# EAGLE design RB3202S_V0.2 (EAGLE 9.4.2)

## Sheet 1 of 4
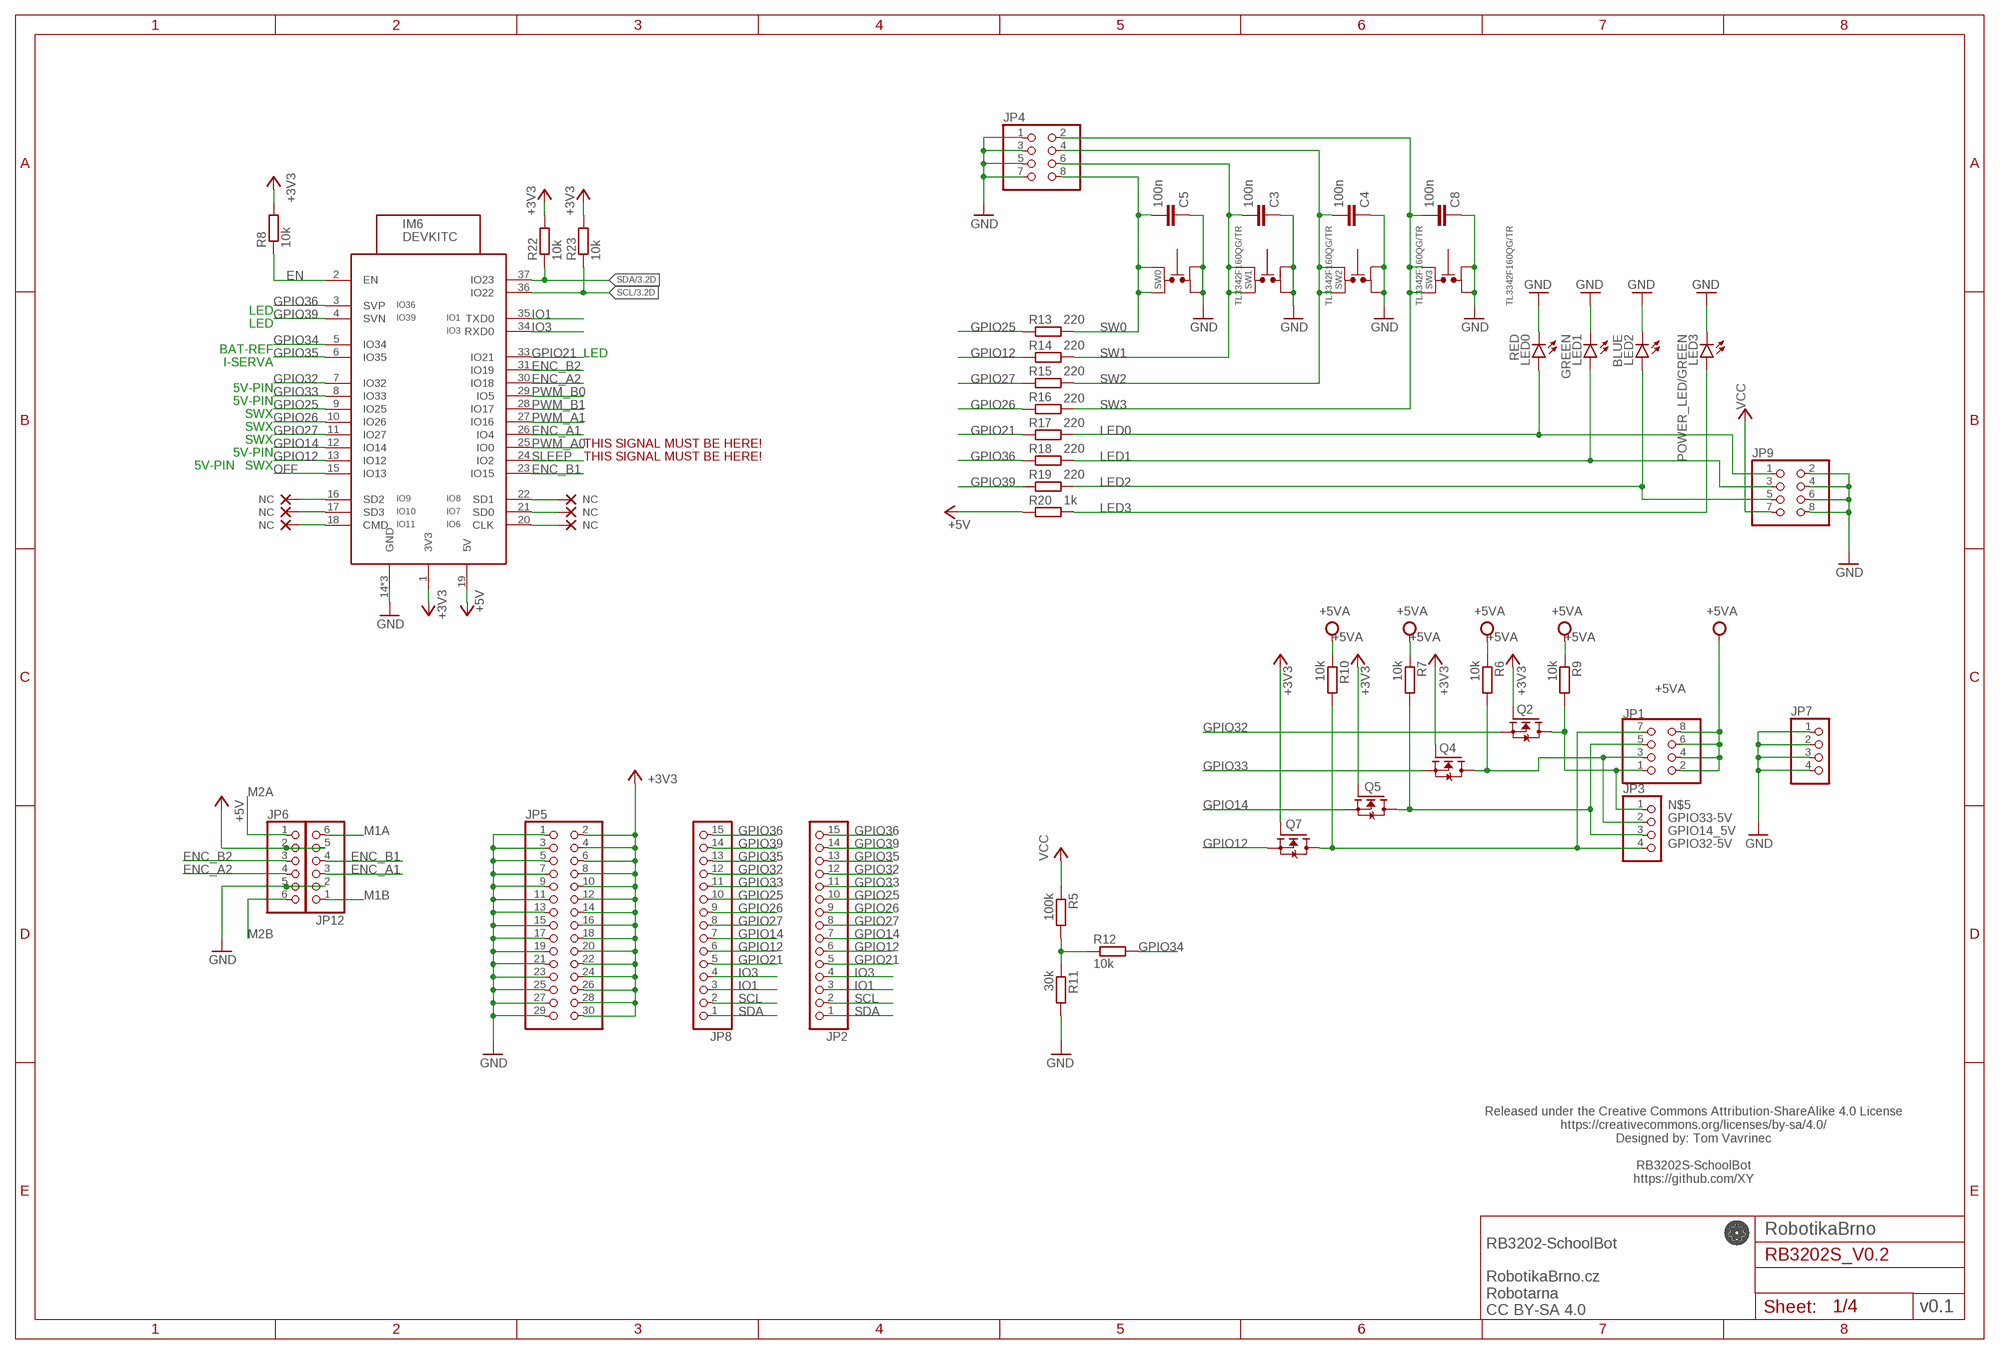
[diagram p0: schematic, sheet 1]

### Parts
C3  100n  C-EUC0402  [C0402]
C4  100n  C-EUC0402  [C0402]
C5  100n  C-EUC0402  [C0402]
C8  100n  C-EUC0402  [C0402]
IM6  DEVKITC  [DEVKITC]
JP1  PINHD-2X4  [2X04]
JP2  PINHD-1X15  [1X15]
JP3  PINHD-1X4  [1X04]
JP4  PINHD-2X4  [2X04]
JP5  PINHD-2X15  [2X15]
JP6  PINHD-1X6  [1X06]
JP7  PINHD-1X4  [1X04]
JP8  PINHD-1X15  [1X15]
JP9  PINHD-2X4  [2X04]
JP12  PINHD-1X6  [1X06]
LED0  RED  LEDSML0603  [SML0603]
LED1  GREEN  LEDSML0603  [SML0603]
LED2  BLUE  LEDSML0603  [SML0603]
LED3  POWER_LED/GREEN  LEDSML0603  [SML0603]
NC1  NC  (no package)
NC2  NC  (no package)
NC3  NC  (no package)
NC4  NC  (no package)
NC5  NC  (no package)
NC6  NC  (no package)
Q2  N-MOSFET-SOT23-GSD  [SOT23]
Q4  N-MOSFET-SOT23-GSD  [SOT23]
Q5  N-MOSFET-SOT23-GSD  [SOT23]
Q7  N-MOSFET-SOT23-GSD  [SOT23]
R5  100k  R-EU_R0402  [R0402]
R6  10k  R-EU_R0402  [R0402]
R7  10k  R-EU_R0402  [R0402]
R8  10k  R-EU_R0402  [R0402]
R9  10k  R-EU_R0402  [R0402]
R10  10k  R-EU_R0402  [R0402]
R11  30k  R-EU_R0402  [R0402]
R12  10k  R-EU_R0402  [R0402]
R13  220  R-EU_R0402  [R0402]
R14  220  R-EU_R0402  [R0402]
R15  220  R-EU_R0402  [R0402]
R16  220  R-EU_R0402  [R0402]
R17  220  R-EU_R0402  [R0402]
R18  220  R-EU_R0402  [R0402]
R19  220  R-EU_R0402  [R0402]
R20  1k  R-EU_R0402  [R0402]
R22  10k  R-EU_R0402  [R0402]
R23  10k  R-EU_R0402  [R0402]
SW0  TL3342F160QG/TR  [TL3342F160QG/TR]
SW1  TL3342F160QG/TR  [TL3342F160QG/TR]
SW2  TL3342F160QG/TR  [TL3342F160QG/TR]
SW3  TL3342F160QG/TR  [TL3342F160QG/TR]

### Nets
+3V3: IM6.1(3V3) JP5.2 JP5.4 JP5.6 JP5.8 JP5.10 JP5.12 JP5.14 JP5.16 JP5.18 JP5.20 JP5.22 JP5.24 JP5.26 JP5.28 JP5.30 Q2.1(G) Q4.1(G) Q5.1(G) Q7.1(G) R8.2 R22.2 R23.2 ; also sheet 2,3,4
+5V: IM6.19(5V) JP6.2 JP12.5 R20.1 ; also sheet 2,4
+5VA: JP1.2 JP1.4 JP1.6 JP1.8 R6.1 R7.1 R9.1 R10.1 ; also sheet 2
EN: IM6.2(EN) R8.1 ; also sheet 2
ENC_A1: IM6.26(IO4) JP12.3
ENC_A2: IM6.30(IO18) JP6.4
ENC_B1: IM6.23(IO15) JP12.4
ENC_B2: IM6.31(IO19) JP6.3
GND: C3.1 C4.1 C5.1 C8.1 IM6.14(GND) IM6.32(GND) IM6.38(GND) JP4.1 JP4.3 JP4.5 JP4.7 JP5.1 JP5.3 JP5.5 JP5.7 JP5.9 JP5.11 JP5.13 JP5.15 JP5.17 JP5.19 JP5.21 JP5.23 JP5.25 JP5.27 JP5.29 JP6.5 JP7.1 JP7.2 JP7.3 JP7.4 JP9.2 JP9.4 JP9.6 JP9.8 JP12.2 LED0.C LED1.C LED2.C LED3.C R11.2 SW0.1 SW0.2 SW1.1 SW1.2 SW2.1 SW2.2 SW3.1 SW3.2 ; also sheet 2,3,4
GPIO12: IM6.13(IO12) JP2.6 JP8.6 Q7.2(S) R14.1
GPIO14: IM6.12(IO14) JP2.7 JP8.7 Q5.2(S)
GPIO14_5V: JP1.5 JP3.3 Q5.3(D) R7.2
GPIO21: IM6.33(IO21) JP2.5 JP8.5 R17.1 ; also sheet 4
GPIO25: IM6.9(IO25) JP2.10 JP8.10 R13.1
GPIO26: IM6.10(IO26) JP2.9 JP8.9 R16.1
GPIO27: IM6.11(IO27) JP2.8 JP8.8 R15.1
GPIO32: IM6.7(IO32) JP2.12 JP8.12 Q2.2(S)
GPIO32-5V: JP1.7 JP3.4 Q7.3(D) R10.2
GPIO33: IM6.8(IO33) JP2.11 JP8.11 Q4.2(S)
GPIO33-5V: JP1.3 JP3.2 Q4.3(D) R6.2
GPIO34: IM6.5(IO34) R12.2
GPIO35: IM6.6(IO35) JP2.13 JP8.13 ; also sheet 2
GPIO36: IM6.3(SVP) JP2.15 JP8.15 R18.1 ; also sheet 4
GPIO39: IM6.4(SVN) JP2.14 JP8.14 R19.1 ; also sheet 4
IO1: IM6.35(TXD0) JP2.3 JP8.3
IO3: IM6.34(RXD0) JP2.4 JP8.4
IO9_NC: IM6.16(SD2) NC1.NC
IO9_NC1: IM6.20(CLK) NC4.NC
IO10_NC: IM6.17(SD3) NC2.NC
IO10_NC1: IM6.21(SD0) NC5.NC
IO11_NC: IM6.18(CMD) NC3.NC
IO11_NC1: IM6.22(SD1) NC6.NC
LED0: JP9.1 LED0.A R17.2
LED1: JP9.3 LED1.A R18.2
LED2: JP9.5 LED2.A R19.2
LED3: LED3.A R20.2
M1A: JP12.6 ; also sheet 2
M1B: JP12.1 ; also sheet 2
M2A: JP6.1 ; also sheet 2
M2B: JP6.6 ; also sheet 2
N$1: R5.2 R11.1 R12.1
N$5: JP1.1 JP3.1 Q2.3(D) R9.2
OFF: IM6.15(IO13) ; also sheet 2
PWM_A0: IM6.25(IO0) ; also sheet 2
PWM_A1: IM6.27(IO16) ; also sheet 2
PWM_B0: IM6.29(IO5) ; also sheet 2
PWM_B1: IM6.28(IO17) ; also sheet 2
SCL: IM6.36(IO22) JP2.2 JP8.2 R23.1 ; also sheet 3
SDA: IM6.37(IO23) JP2.1 JP8.1 R22.1 ; also sheet 3
SLEEP: IM6.24(IO2) ; also sheet 2
SW0: C5.2 JP4.8 R13.2 SW0.3 SW0.4
SW1: C3.2 JP4.6 R14.2 SW1.3 SW1.4
SW2: C4.2 JP4.4 R15.2 SW2.3 SW2.4
SW3: C8.2 JP4.2 R16.2 SW3.3 SW3.4
VCC: JP9.7 R5.1 ; also sheet 2

### Notes on the sheet
- LED
- LED
- BAT-REF
- I-SERVA | LED
- 5V-PIN
- 5V-PIN
- SWX
- SWX
- SWX
- 5V-PIN | THIS SIGNAL MUST BE HERE!
- 5V-PIN | SWX | THIS SIGNAL MUST BE HERE!
- Released under the Creative Commons Attribution-ShareAlike 4.0 License
  https://creativecommons.org/licenses/by-sa/4.0/
  Designed by: Tom Vavrinec
  
  RB3202S-SchoolBot
  https://github.com/XY
- RobotikaBrno
- v0.1
- RB3202-SchoolBot
  
  RobotikaBrno.cz
  Robotarna
  CC BY-SA 4.0

## Sheet 2 of 4
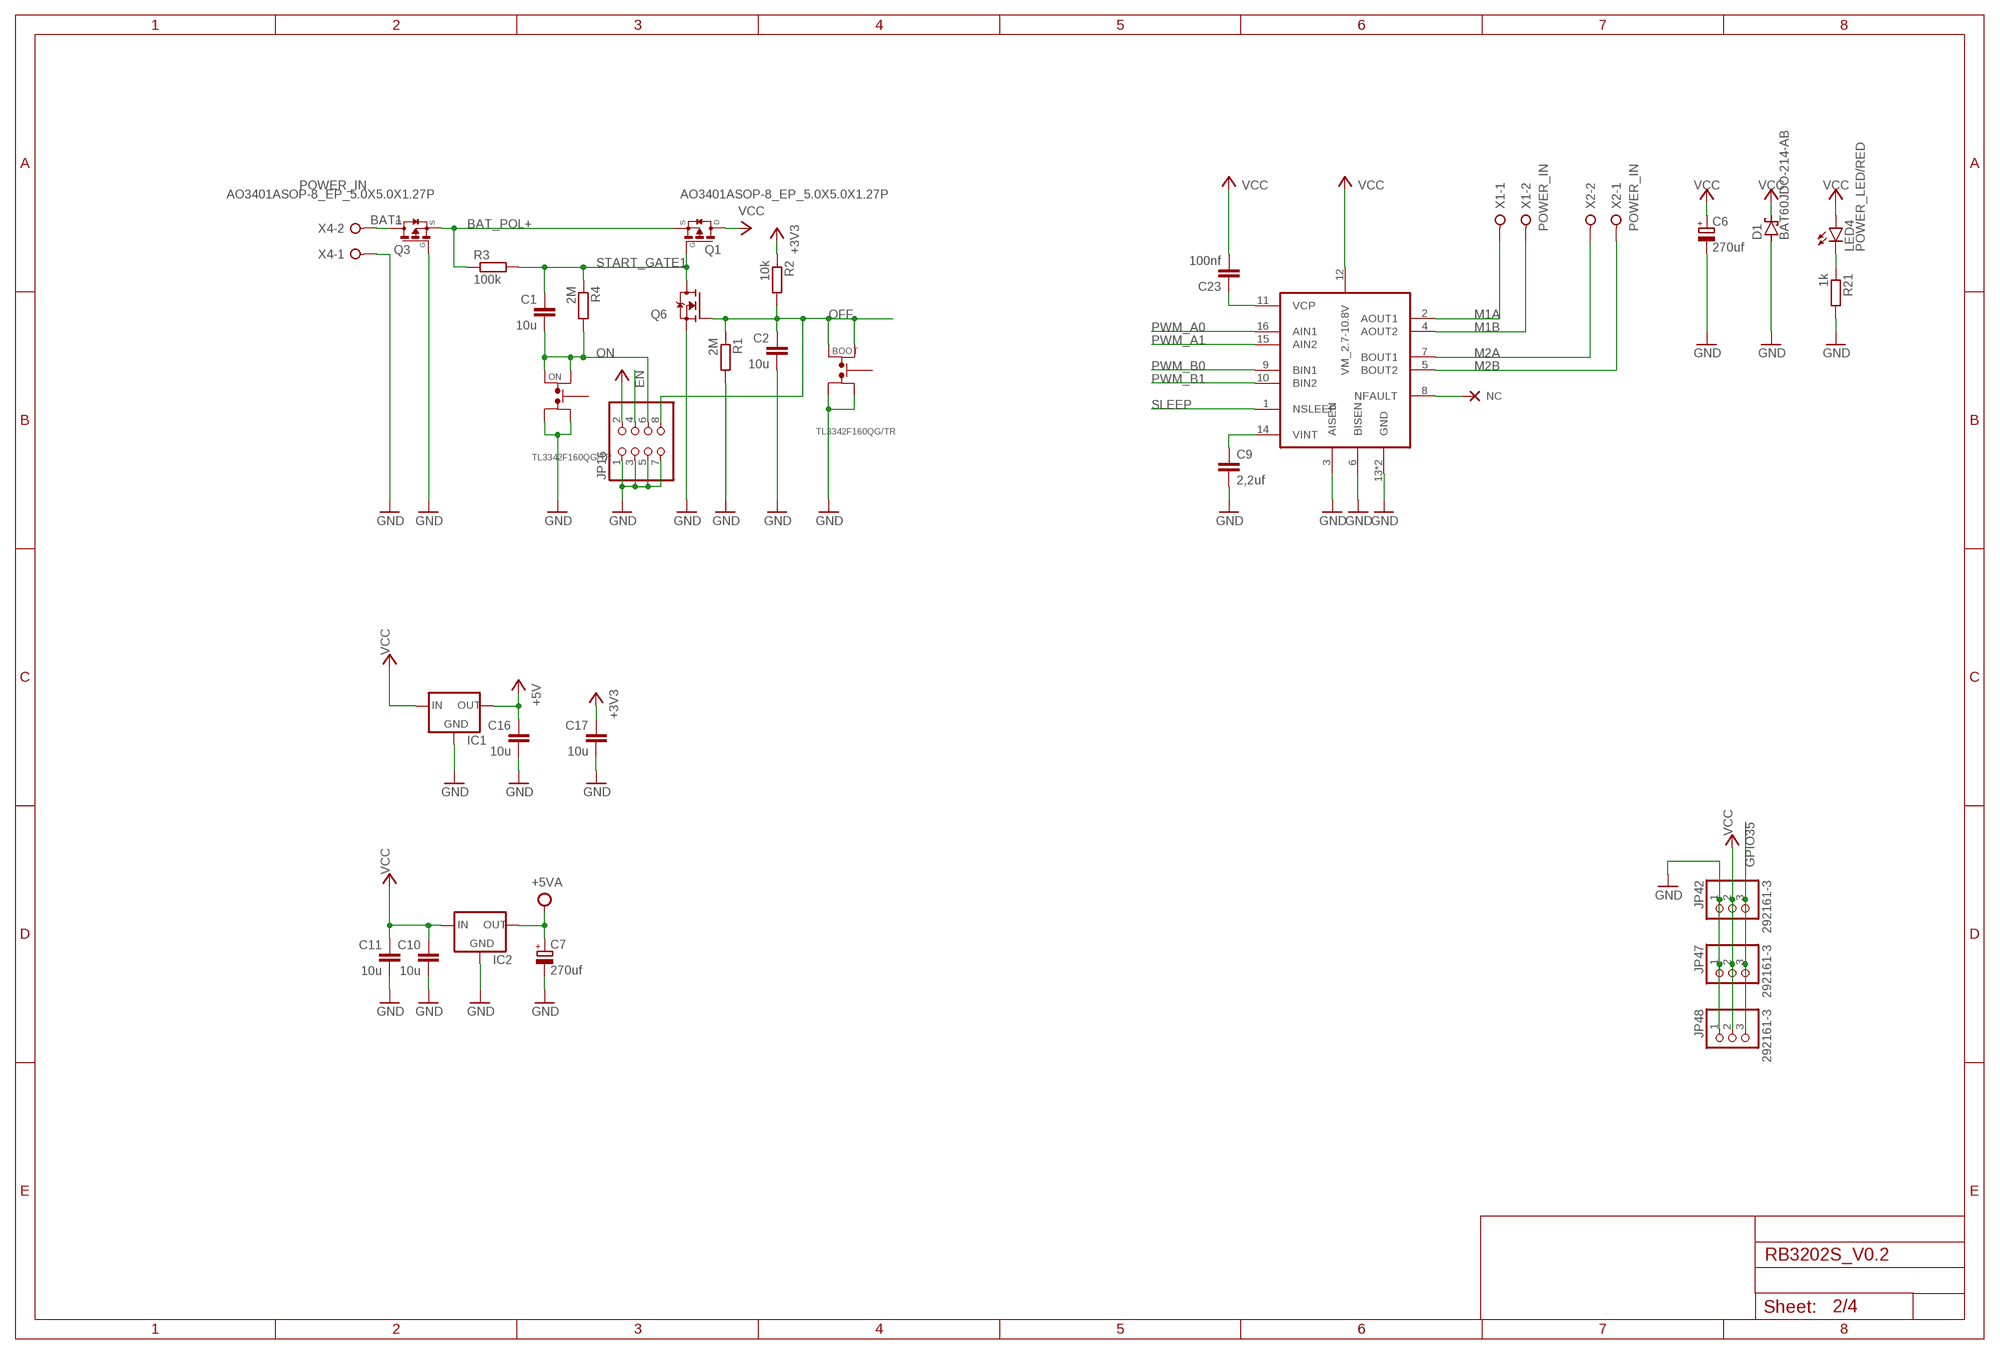
[diagram p1: schematic, sheet 2]

### Parts
BOOT  TL3342F160QG/TR  [TL3342F160QG/TR]
C1  10u  C-EUC1206  [C1206]
C2  10u  C-EUC1206  [C1206]
C6  270uf  CPOL-EU140CLH-1010  [140CLH-1010]
C7  270uf  CPOL-EU140CLH-1010  [140CLH-1010]
C9  2,2uf  C-EUC0805  [C0805]
C10  10u  C-EUC1206  [C1206]
C11  10u  C-EUC1206  [C1206]
C16  10u  C-EUC1206  [C1206]
C17  10u  C-EUC1206  [C1206]
C23  100nf  C-EUC0402  [C0402]
D1  BAT60JDO-214-AB  [DO214BA]
IC1  LM1117  [SOT223]
IC2  LM1117  [SOT223]
JP16  PINHD-2X4  [2X04]
JP42  292161-3  [292161-3]
JP47  292161-3  [292161-3]
JP48  292161-3  [292161-3]
LED4  POWER_LED/RED  LEDSML0603  [SML0603]
NC7  NC  (no package)
ON  TL3342F160QG/TR  [TL3342F160QG/TR]
Q1  AO3401ASOP-8_EP_5.0X5.0X1.27P  [SOP-8_EP_5.0X5.0X1.27P]
Q3  AO3401ASOP-8_EP_5.0X5.0X1.27P  [SOP-8_EP_5.0X5.0X1.27P]
Q6  N-MOSFET-SOT23-GSD  [SOT23]
R1  2M  R-EU_R0402  [R0402]
R2  10k  R-EU_R0402  [R0402]
R3  100k  R-EU_R0402  [R0402]
R4  2M  R-EU_R0402  [R0402]
R21  1k  R-EU_R0402  [R0402]
U$9  DRV8833CPWPR  [SOP65P640X120-17N]
X1  POWER_IN  W237-02P  [W237-132]
X2  POWER_IN  W237-02P  [W237-132]
X4  POWER_IN  W237-02P  [W237-132]

### Nets
+3V3: C17.1 R2.1 ; also sheet 1,3,4
+5V: C16.1 IC1.2(OUT) IC1.4(OUT) JP16.2 ; also sheet 1,4
+5VA: C7.+ IC2.2(OUT) IC2.4(OUT) ; also sheet 1
BAT1: Q3.5(D) Q3.6(D) Q3.7(D) Q3.8(D) Q3.9(D) X4.2
BAT_POL+: Q1.1(S) Q1.2(S) Q1.3(S) Q3.1(S) Q3.2(S) Q3.3(S) R3.1
EN: JP16.4 ; also sheet 1
GND: BOOT.1 BOOT.2 C2.2 C6.- C7.- C9.2 C10.2 C11.2 C16.2 C17.2 D1.A IC1.1(GND) IC2.1(GND) JP16.1 JP16.3 JP16.5 JP16.7 JP42.1 JP47.1 JP48.1 ON.1 ON.2 Q3.4(G) Q6.2(S) R1.2 R21.2 U$9.3(AISEN) U$9.6(BISEN) U$9.13(GND) U$9.17(GND) X4.1 ; also sheet 1,3,4
GPIO35: JP42.3 JP47.3 JP48.3 ; also sheet 1
IO9_NC2: NC7.NC U$9.8(NFAULT)
M1A: U$9.2(AOUT1) X1.1 ; also sheet 1
M1B: U$9.4(AOUT2) X1.2 ; also sheet 1
M2A: U$9.7(BOUT1) X2.2 ; also sheet 1
M2B: U$9.5(BOUT2) X2.1 ; also sheet 1
N$2: LED4.C R21.1
N$23: C9.1 U$9.14(VINT)
N$25: C23.1 U$9.11(VCP)
OFF: BOOT.3 BOOT.4 C2.1 JP16.8 Q6.1(G) R1.1 R2.2 ; also sheet 1
ON: C1.2 JP16.6 ON.3 ON.4 R4.2
PWM_A0: U$9.16(AIN1) ; also sheet 1
PWM_A1: U$9.15(AIN2) ; also sheet 1
PWM_B0: U$9.9(BIN1) ; also sheet 1
PWM_B1: U$9.10(BIN2) ; also sheet 1
SLEEP: U$9.1(NSLEEP) ; also sheet 1
START_GATE1: C1.1 Q1.4(G) Q6.3(D) R3.2 R4.1
VCC: C6.+ C10.1 C11.1 C23.2 D1.C IC1.3(IN) IC2.3(IN) JP42.2 JP47.2 JP48.2 LED4.A Q1.5(D) Q1.6(D) Q1.7(D) Q1.8(D) Q1.9(D) U$9.12(VM_2.7-10.8V) ; also sheet 1

## Sheet 3 of 4
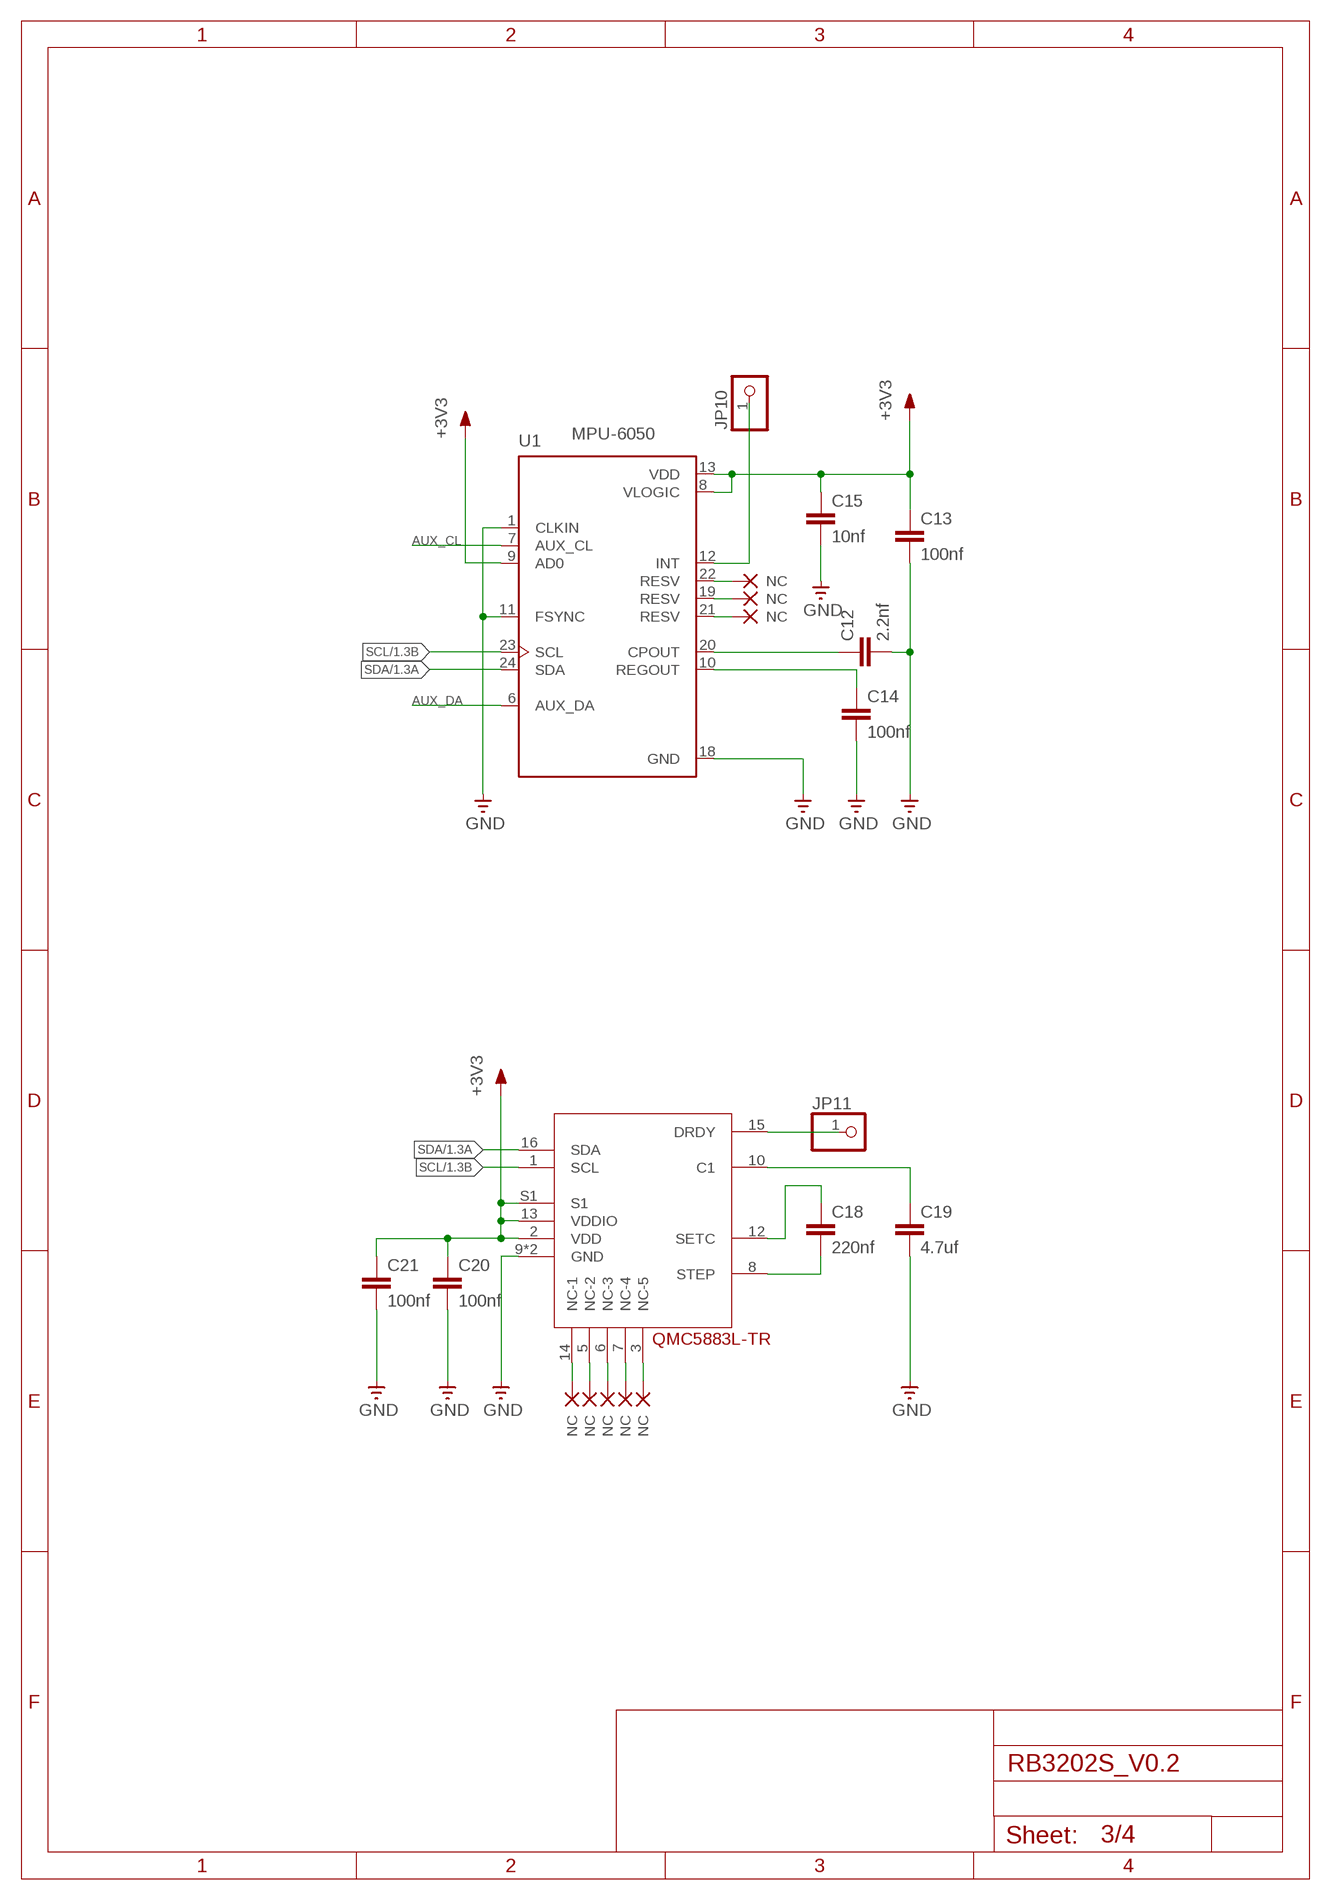
[diagram p2: schematic, sheet 3]

### Parts
C12  2.2nf  C-EUC0402  [C0402]
C13  100nf  C-EUC0402  [C0402]
C14  100nf  C-EU  [C0402P]
C15  10nf  C-EUC0402  [C0402]
C18  220nf  C-EUC0402  [C0402]
C19  4.7uf  C-EUC0805  [C0805]
C20  100nf  C-EU  [C0402P]
C21  100nf  C-EU  [C0402P]
IC3  QMC5883L-TR  [QMC5882L-TR]
JP10  PINHD-1X1  [1X01]
JP11  PINHD-1X1  [1X01]
NC8  NC  (no package)
NC9  NC  (no package)
NC10  NC  (no package)
NC11  NC  (no package)
NC12  NC  (no package)
NC13  NC  (no package)
NC14  NC  (no package)
NC15  NC  (no package)
U1  MPU-6050  [QFN50P400X400X95-24N]

### Nets
+3V3: C13.1 C15.1 C20.1 C21.1 IC3.2(VDD) IC3.13(VDDIO) IC3.S1 U1.8(VLOGIC) U1.9(AD0) U1.13(VDD) ; also sheet 1,2,4
AUX_CL: U1.7(AUX_CL)
AUX_DA: U1.6(AUX_DA)
GND: C12.2 C13.2 C14.2 C15.2 C19.2 C20.2 C21.2 IC3.9(GND) IC3.11(GND) U1.1(CLKIN) U1.11(FSYNC) U1.18(GND) ; also sheet 1,2,4
INT_MPU5060: JP10.1 U1.12(INT)
IO9_NC3: IC3.5(NC-2) NC9.NC
IO9_NC4: NC8.NC U1.19(RESV)
IO9_NC5: NC14.NC U1.21(RESV)
IO9_NC6: IC3.14(NC-1) NC11.NC
IO9_NC7: IC3.3(NC-5) NC12.NC
IO9_NC8: IC3.7(NC-4) NC15.NC
IO10_NC2: IC3.6(NC-3) NC10.NC
IO10_NC4: NC13.NC U1.22(RESV)
N$3: C12.1 U1.20(CPOUT)
N$4: C14.1 U1.10(REGOUT)
N$60: C18.1 IC3.12(SETC)
N$62: C18.2 IC3.8(STEP)
N$66: C19.1 IC3.10(C1)
QMC5883-INTERRUPT: IC3.15(DRDY) JP11.1
SCL: IC3.1(SCL) U1.23(SCL) ; also sheet 1
SDA: IC3.16(SDA) U1.24(SDA) ; also sheet 1

## Sheet 4 of 4
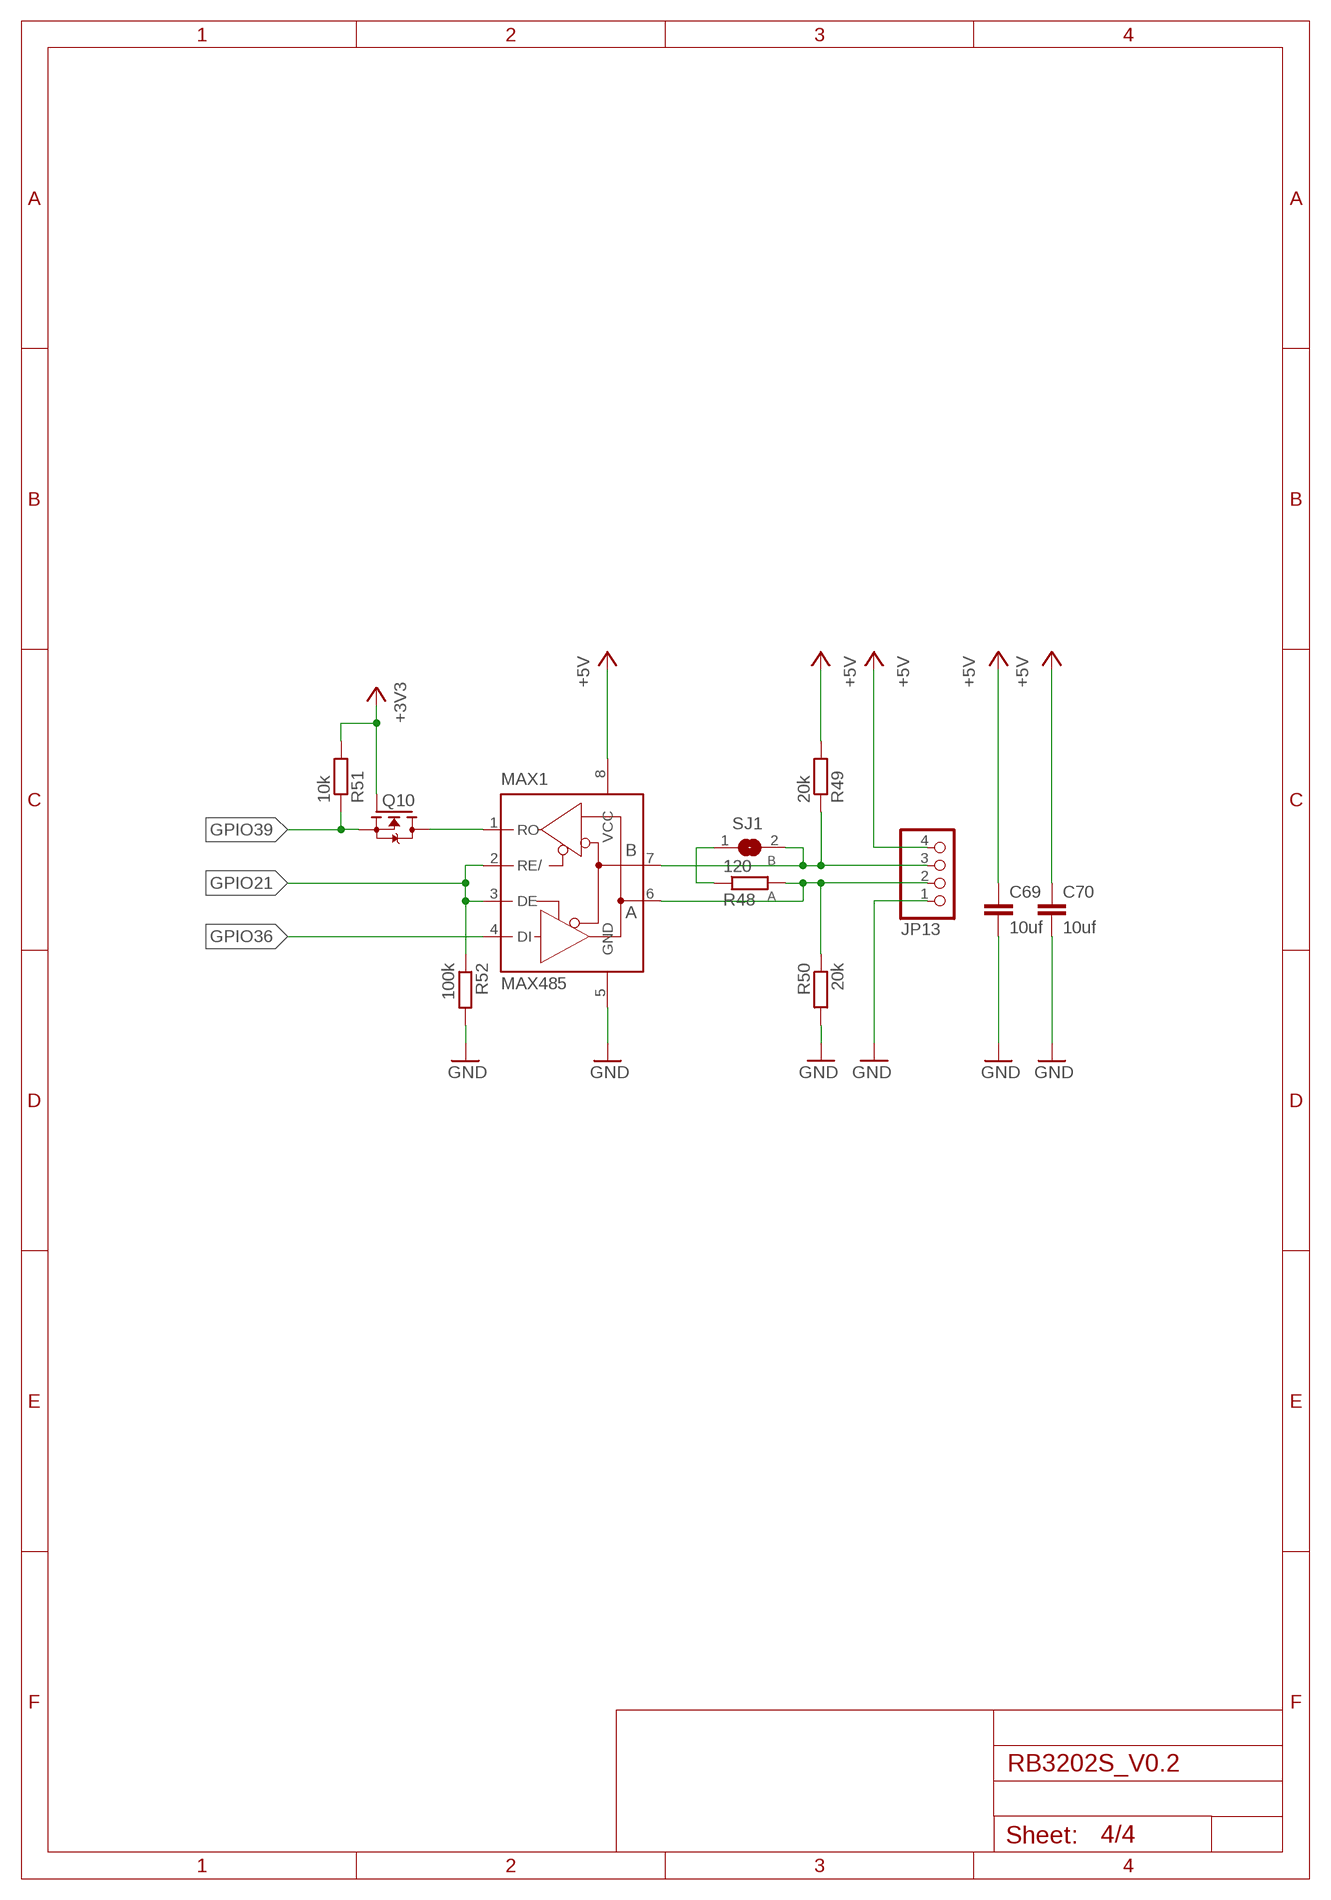
[diagram p3: schematic, sheet 4]

### Parts
C69  10uf  C-EUC0805  [C0805]
C70  10uf  C-EUC0805  [C0805]
JP13  PINHD-1X4  [1X04]
MAX1  MAX485  [SO08]
Q10  N-MOSFET-SOT23-GSD  [SOT23]
R48  120  R-EU_R0402  [R0402]
R49  20k  R-EU_R0402  [R0402]
R50  20k  R-EU_R0402  [R0402]
R51  10k  R-EU_R0402  [R0402]
R52  100k  R-EU_R0402  [R0402]
SJ1  SJ  [SJ]

### Nets
+3V3: Q10.1(G) R51.2 ; also sheet 1,2,3
+5V: C69.1 C70.1 JP13.4 MAX1.8(VCC) R49.2 ; also sheet 1,2
A: JP13.2 MAX1.6(A) R48.2 R50.1
B: JP13.3 MAX1.7(B) R49.1 SJ1.2
GND: C69.2 C70.2 JP13.1 MAX1.5(GND) R50.2 R52.2 ; also sheet 1,2,3
GPIO21: MAX1.2(RE/) MAX1.3(DE) R52.1 ; also sheet 1
GPIO36: MAX1.4(DI) ; also sheet 1
GPIO39: Q10.2(S) R51.1 ; also sheet 1
N$6: R48.1 SJ1.1
RX-485-5V: MAX1.1(RO) Q10.3(D)

## Library data of the parts
BOOT ON SW0 SW1-SW3 = Switch:TL3342F160QG/TR: SWITCH TACTILE SPST-NO 0.05A 12V Manufacturer's datasheet <http://spec_sheets.e-switch.com/specs/P010632.pdf>; CREATED_BY: PCBLayout.com; DIGI_KEY_PART_NUMBER: EG2531CT-ND; MANUFACTURER: E-Switch; MPN: TL3342F160QG/TR; PACKAGE: SPST_NO
C1-C5 C8 C10-C21 = rcl_upravena:C-EU: CAPACITOR, European symbol
C6 C7 = rcl:CPOL-EU: POLARIZED CAPACITOR, European symbol; SPICEPREFIX: C
C9 C23 = resistor:C-EU: CAPACITOR, European symbol
C69 C70 = rcl:C-EU: CAPACITOR, European symbol; SPICEPREFIX: C
D1 = diode:BAT60J: Schottky barrier diode Source: www.st.com, BAT60J.pdf
IC1 IC2 = v-reg-2:LM1117
IC3 = QMC5883L-TR:QMC5883L-TR
IM6 = esp32:DEVKITC
JP1 JP4 JP9 JP16 = pinhead:PINHD-2X4: PIN HEADER
JP2 JP8 = pinhead:PINHD-1X15: PIN HEADER
JP3 JP7 JP13 = pinhead:PINHD-1X4: PIN HEADER
JP5 = pinhead:PINHD-2X15: PIN HEADER
JP6 JP12 = pinhead:PINHD-1X6: PIN HEADER
JP10 JP11 = pinhead:PINHD-1X1: PIN HEADER
JP42 JP47 JP48 = iServo_connector:292161-3
LED0 LED1-LED4 = led:LED: LED OSRAM: - CHIPLED LG R971, LG N971, LY N971, LG Q971, LY Q971, LO R971, LY R971 LH N974, LH R974 LS Q976, LO Q976, LY Q976 LO Q996 - Hyper CHIPLED LW Q18S LB Q993, LB Q99A, LB R99A - SideLED LS A670, LO A670, LY A670, LG A670, LP A670 LB A673, LV A673, LT A673, LW A673 LH A674 LY A675 LS A676, LA A676, LO A676, LY A676, LW A676 LS A679, LY A679, LG A679 - Hyper Micro SIDELED® LS Y876, LA Y876, LO Y876, LY Y876 LT Y87S - SmartLED LW L88C, LW L88S LB L89C, LB L89S, LG L890 LS L89K, LO L89K, LY L89K LS L896, LA L896, LO L896, LY L896 - TOPLED LS T670, LO T670, LY T670, LG T670, LP T670 LSG T670, LSP T670, LSY T670, LOP T670, LYG T670 LG T671, LOG T671, LSG T671 LB T673, LV T673, LT T673, LW T673 LH T674 LS T676, LA T676, LO T676, LY T676, LB T676, LH T676, LSB T676, LW T676 LB T67C, LV T67C, LT T67C, LS T67K, LO T67K, LY T67K, LW E67C LS E67B, LA E67B, LO E67B, LY E67B, LB E67C, LV E67C, LT E67C LW T67C LS T679, LY T679, LG T679 LS T770, LO T770, LY T770, LG T770, LP T770 LB T773, LV T773, LT T773, LW T773 LH T774 LS E675, LA E675, LY E675, LS T675 LS T776, LA T776, LO T776, LY T776, LB T776 LHGB T686 LT T68C, LB T68C - Hyper Mini TOPLED® LB M676 - Mini TOPLED Santana® LG M470 LS M47K, LO M47K, LY M47K Source: http://www.osram.convergy.de LUXEON: - LUMILED® LXK2-PW12-R00, LXK2-PW12-S00, LXK2-PW14-U00, LXK2-PW14-V00 LXK2-PM12-R00, LXK2-PM12-S00, LXK2-PM14-U00 LXK2-PE12-Q00, LXK2-PE12-R00, LXK2-PE12-S00, LXK2-PE14-T00, LXK2-PE14-U00 LXK2-PB12-K00, LXK2-PB12-L00, LXK2-PB12-M00, LXK2-PB14-N00, LXK2-PB14-P00, LXK2-PB14-Q00 LXK2-PR12-L00, LXK2-PR12-M00, LXK2-PR14-Q00, LXK2-PR14-R00 LXK2-PD12-Q00, LXK2-PD12-R00, LXK2-PD12-S00 LXK2-PH12-R00, LXK2-PH12-S00 LXK2-PL12-P00, LXK2-PL12-Q00, LXK2-PL12-R00 Source: www.luxeon.com KINGBRIGHT: KA-3528ASYC Source: www.kingbright.com
MAX1 = maxim:MAX485
NC1-NC15 = NC:NC: _EXTERNAL_
Q1 Q3 = transistor-fet:AO3401A: P-Channel Enhancement MOSFET
Q2 Q4-Q7 Q10 = transistors:N-MOSFET
R1-R4 R8 R21-R23 = rcl_upravena:R-EU_: RESISTOR, European symbol
R5-R7 R9-R20 R48-R52 = rcl:R-EU_: RESISTOR, European symbol; SPICEPREFIX: R
SJ1 = jumper:SJ: SMD solder JUMPER
U1 = MPU-6050:MPU-6050: MPU-6050 Six-Axis (Gyro + Accelerometer) MEMS MotionTracking™ Devices; AVAILABILITY: Unavailable; DESCRIPTION: 3-axis gyroscope, 3-axis accelerometer in a 4x4x0.9 housing; MF: TDK InvenSense; MP: MPU-6050; PACKAGE: QFN-24 InvenSense; PRICE: None
U$9 = DRV8833CPWPR:DRV8833CPWPR: 1A Low Voltage Stepper or Single/Dual Brushed DC Motor Driver (PWM Ctrl) 16-HTSSOP -40 to 85; AVAILABILITY: Unavailable; DESCRIPTION: Motor Driver Power MOSFET PWM 16-HTSSOP; MF: Texas Instruments; MP: DRV8833CPWPR; PACKAGE: HTSSOP-16 Texas Instruments; PRICE: None
X1 X2 X4 = con-wago-508:W237-02P: WAGO SREW CLAMP; OC_FARNELL: unknown; OC_NEWARK: unknown

## Net classes
0 default: width 0.2 mm, drill 0.35 mm, clearance 0.2 mm

## Board
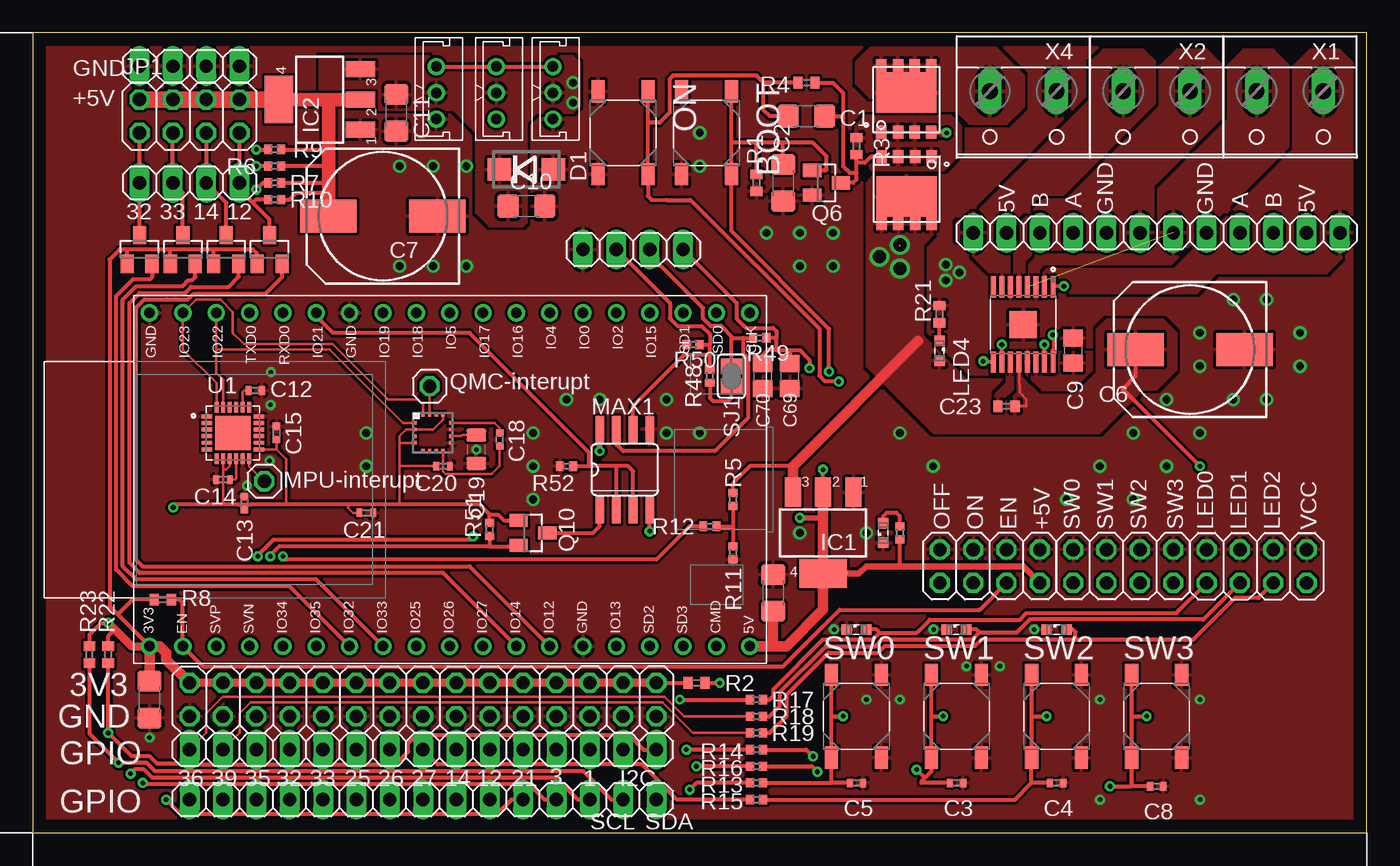
[diagram p4: board, top side]
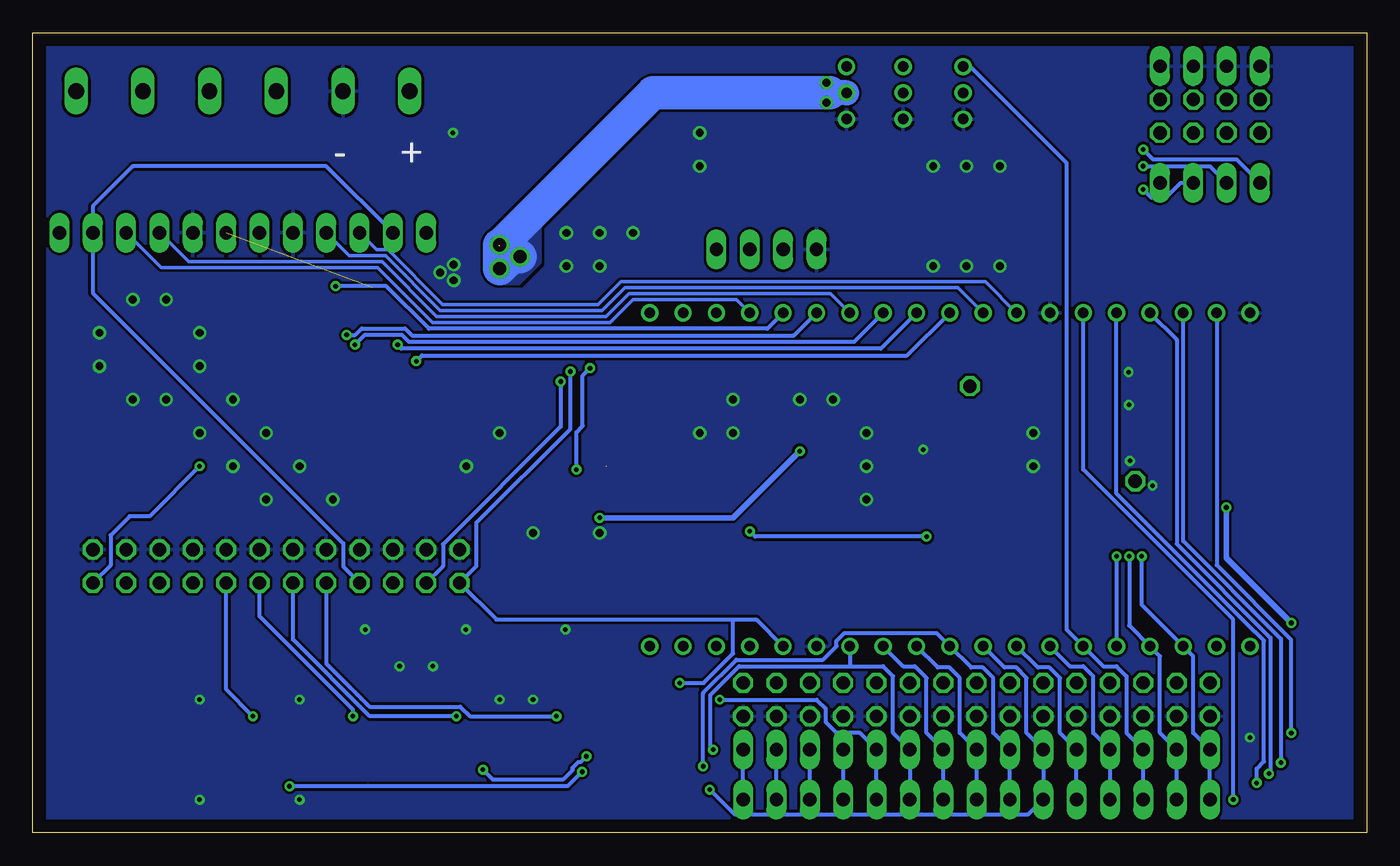
[diagram p5: board, bottom side, seen from below]

Size 101.6 x 60.96 mm. Coordinates in mm from the lower left corner, seen from the top.
Outline: 0,0 101.6,0 101.6,60.96 0,60.96 0,0
Copper layers (1*16): Top 0.035mm / dielectric 1.5mm / Bottom 0.035mm
Design rules "default *": minimum track width 6mil, minimum drill 0.35mm, track to track 6mil, track to pad 6mil, pad to pad 6mil, via to via 6mil, smd to smd 6mil, copper to edge 40mil, drill to drill 6mil, minimum pad ring 10mil, minimum via ring 8mil, stop-mask expansion 4mil, vias tented up to drill 0mil, thermal gap 10mil

### Footprints (pad centres in the part's own frame; a part is rotated, then mirrored left to right if it is on the bottom)
TL3342F160QG/TR = smd 1.7 x 1: 1 -3.15,-1.9; 2 3.15,-1.9; 3 -3.15,1.9; 4 3.15,1.9
C1206 = smd 1.6 x 1.8: 1 -1.4,0; 2 1.4,0
C0402 = smd 0.5 x 0.6: 1 -0.5,0; 2 0.5,0
140CLH-1010 = smd 4.3 x 2.5: + 4.15,0; - -4.15,0
C0805 = smd 1.3 x 1.5: 1 -0.95,0; 2 0.95,0
C0402P = smd 0.45 x 0.6: 1 -0.525,0; 2 0.525,0
C0805' = smd 1 x 1.5: 1 -1.1,0; 2 1.05,0
C0402' = smd 0.7 x 0.9: 1 -0.65,0; 2 0.65,0
DO214BA = smd 1.8 x 1.7: A 2.05,0; C -2.05,0
SOT223 = smd 1.219 x 2.235: 1 -2.311,-3.099; 2 0,-3.099; 3 2.311,-3.099 | smd 3.6 x 2.2: 4 0,3.099
QMC5882L-TR = smd 0.325 x 0.25: 1 -1.397,0.762; 2 -1.397,0.254; 3 -1.397,-0.254; 9 1.397,-0.762; 10 1.397,-0.254; 11 1.397,0.254; 12 1.397,0.762; S1 -1.397,-0.762 | smd 0.25 x 0.325: 5 -0.762,-1.397; 6 -0.254,-1.397; 7 0.254,-1.397; 8 0.762,-1.397; 13 0.762,1.397; 14 0.254,1.397; 15 -0.254,1.397; 16 -0.762,1.397
DEVKITC = drill 0.8: 1 -12.7,46.99; 2 -12.7,44.45; 3 -12.7,41.91; 4 -12.7,39.37; 5 -12.7,36.83; 6 -12.7,34.29; 7 -12.7,31.75; 8 -12.7,29.21; 9 -12.7,26.67; 10 -12.7,24.13; 11 -12.7,21.59; 12 -12.7,19.05; 13 -12.7,16.51; 14 -12.7,13.97; 15 -12.7,11.43; 16 -12.7,8.89; 17 -12.7,6.35; 18 -12.7,3.81; 19 -12.7,1.27; 20 12.7,1.27; 21 12.7,3.81; 22 12.7,6.35; 23 12.7,8.89; 24 12.7,11.43; 25 12.7,13.97; 26 12.7,16.51; 27 12.7,19.05; 28 12.7,21.59; 29 12.7,24.13; 30 12.7,26.67; 31 12.7,29.21; 32 12.7,31.75; 33 12.7,34.29; 34 12.7,36.83; 35 12.7,39.37; 36 12.7,41.91; 37 12.7,44.45; 38 12.7,46.99
2X04 = drill 1.016 octagon: 1 -3.81,-1.27; 2 -3.81,1.27; 3 -1.27,-1.27; 4 -1.27,1.27; 5 1.27,-1.27; 6 1.27,1.27; 7 3.81,-1.27; 8 3.81,1.27
1X15 = drill 1.016 long: 1 -17.78,0; 2 -15.24,0; 3 -12.7,0; 4 -10.16,0; 5 -7.62,0; 6 -5.08,0; 7 -2.54,0; 8 0,0; 9 2.54,0; 10 5.08,0; 11 7.62,0; 12 10.16,0; 13 12.7,0; 14 15.24,0; 15 17.78,0
1X04 = drill 1.016 long: 1 -3.81,0; 2 -1.27,0; 3 1.27,0; 4 3.81,0
2X15 = drill 1.016 octagon: 1 -17.78,-1.27; 2 -17.78,1.27; 3 -15.24,-1.27; 4 -15.24,1.27; 5 -12.7,-1.27; 6 -12.7,1.27; 7 -10.16,-1.27; 8 -10.16,1.27; 9 -7.62,-1.27; 10 -7.62,1.27; 11 -5.08,-1.27; 12 -5.08,1.27; 13 -2.54,-1.27; 14 -2.54,1.27; 15 0,-1.27; 16 0,1.27; 17 2.54,-1.27; 18 2.54,1.27; 19 5.08,-1.27; 20 5.08,1.27; 21 7.62,-1.27; 22 7.62,1.27; 23 10.16,-1.27; 24 10.16,1.27; 25 12.7,-1.27; 26 12.7,1.27; 27 15.24,-1.27; 28 15.24,1.27; 29 17.78,-1.27; 30 17.78,1.27
1X06 = drill 1.016 long: 1 -6.35,0; 2 -3.81,0; 3 -1.27,0; 4 1.27,0; 5 3.81,0; 6 6.35,0
1X01 = drill 1.016 octagon: 1 0,0
292161-3 = drill 0.8: 1 -2,0; 2 0,0; 3 2,0
SML0603 = smd 0.8 x 0.8: A 0.75,0; C -0.75,0
SO08 = smd 0.66 x 2.032: 1 -1.905,-3.073; 2 -0.635,-3.073; 3 0.635,-3.073; 4 1.905,-3.073; 5 1.905,3.073; 6 0.635,3.073; 7 -0.635,3.073; 8 -1.905,3.073
SOP-8_EP_5.0X5.0X1.27P = smd 0.8 x 1: 1 1.915,2.5; 2 0.645,2.5; 3 -0.625,2.5; 4 -1.895,2.5; 5 -1.895,-2.58; 6 -0.625,-2.58; 7 0.645,-2.58; 8 1.915,-2.58 | smd 4.61 x 3.1: 9 0.01,-0.53
SOT23 = smd 1 x 1.4: 1 -0.95,-1.1; 2 0.95,-1.1; 3 0,1.1
R0402 = smd 0.7 x 0.9: 1 -0.65,0; 2 0.65,0
R0402' = smd 0.6 x 0.7: 1 -0.5,0; 2 0.5,0
SJ = smd 1.168 x 1.6: 1 -0.762,0; 2 0.762,0
QFN50P400X400X95-24N = smd 0.8 x 0.3: 1 -1.97,1.25; 2 -1.97,0.75; 3 -1.97,0.25; 4 -1.97,-0.25; 5 -1.97,-0.75; 6 -1.97,-1.25; 13 1.97,-1.25; 14 1.97,-0.75; 15 1.97,-0.25; 16 1.97,0.25; 17 1.97,0.75; 18 1.97,1.25 | smd 0.3 x 0.8: 7 -1.25,-1.97; 8 -0.75,-1.97; 9 -0.25,-1.97; 10 0.25,-1.97; 11 0.75,-1.97; 12 1.25,-1.97; 19 1.25,1.97; 20 0.75,1.97; 21 0.25,1.97; 22 -0.25,1.97; 23 -0.75,1.97; 24 -1.25,1.97 | smd 2.7 x 2.6: P$1 0,0
SOP65P640X120-17N = smd 1.57 x 0.41: 1 -2.87,2.275; 2 -2.87,1.625; 3 -2.87,0.975; 4 -2.87,0.325; 5 -2.87,-0.325; 6 -2.87,-0.975; 7 -2.87,-1.625; 8 -2.87,-2.275; 9 2.87,-2.275; 10 2.87,-1.625; 11 2.87,-0.975; 12 2.87,-0.325; 13 2.87,0.325; 14 2.87,0.975; 15 2.87,1.625; 16 2.87,2.275 | smd 2.07 x 2.105: 17 0,0
W237-132 = drill 1.194 long: 1 -2.54,-0.635; 2 2.54,-0.635

### Placement (x,y rotation side)
BOOT  51.31,53.34 270 top
C1  58.93,54.61 180 top
C2  57.15,49.53 270 top
C3  70.36,3.81 180 top
C4  77.98,3.81 180 top
C5  62.74,3.81 180 top
C6  88.14,36.83 180 top
C7  26.67,46.99 180 top
C8  85.6,3.56 180 top
C9  79.25,36.75 90 top
C10  37.59,47.75 0 top
C11  27.69,54.86 270 top
C12  16.94,33.71 0 top
C13  16.13,25.12 90 top
C14  14.49,26.92 180 top
C15  18.57,30.48 90 top
C16  56.39,18.29 90 top
C17  8.89,10.16 270 top
C18  35.56,29.97 270 top
C19  4.7uf  [C0805']  33.78,29.21 270 top
C20  31.24,27.94 0 top
C21  25.4,24.38 0 top
C23  100nf  [C0402']  74.17,32.51 0 top
C69  57.66,34.8 270 top
C70  55.6,34.8 270 top
D1  37.59,50.55 0 top
IC1  60.2,22.86 180 top
IC2  21.84,55.88 90 top
IC3  30.48,30.48 0 top
IM6  55.88,26.92 90 top
JP1  11.94,54.61 0 top
JP2  29.72,6.35 180 top
JP3  11.94,49.53 0 top
JP4  83.06,20.32 180 top
JP5  29.72,10.16 0 top
JP6  77.98,45.72 0 top
JP7  11.94,58.42 0 top
JP8  29.72,2.54 180 top
JP9  93.22,20.32 0 top
JP10  17.63,26.8 0 top
JP11  30.23,34.04 0 top
JP12  93.22,45.72 0 top
JP13  45.72,44.45 0 top
JP16  72.9,20.32 180 top
JP42  30.73,56.39 90 top
JP47  39.62,56.39 90 top
JP48  35.31,56.39 90 top
LED0  62.74,15.49 0 top
LED1  70.36,15.49 0 top
LED2  77.98,15.49 0 top
LED3  64.77,22.86 90 top
LED4  69.06,36.73 270 top
MAX1  45.09,27.69 0 top
ON  44.96,53.34 270 top
Q1  66.55,49.02 0 top
Q2  8.13,44.45 0 top
Q3  66.55,55.88 180 top
Q4  11.43,44.45 0 top
Q5  14.73,44.45 0 top
Q6  60.45,49.53 270 top
Q7  18.03,44.45 0 top
Q10  38.1,22.86 270 top
R1  55.12,49.53 270 top
R2  50.55,11.43 0 top
R3  62.74,52.32 270 top
R4  58.93,57.15 180 top
R5  100k  [R0402']  53.34,25.4 270 top
R6  10k  [R0402']  18.41,50.8 180 top
R7  10k  [R0402']  18.41,49.53 180 top
R8  9.91,17.78 180 top
R9  10k  [R0402']  18.41,52.07 180 top
R10  10k  [R0402']  18.41,48.26 180 top
R11  30k  [R0402']  53.34,21.34 270 top
R12  10k  [R0402']  51.56,23.37 180 top
R13  220  [R0402']  55.12,3.81 0 top
R14  220  [R0402']  55.12,6.35 0 top
R15  220  [R0402']  55.12,2.54 0 top
R16  220  [R0402']  55.12,5.08 0 top
R17  220  [R0402']  55.12,10.16 0 top
R18  220  [R0402']  55.12,8.89 0 top
R19  220  [R0402']  55.12,7.62 0 top
R20  1k  [R0402']  66.04,22.86 90 top
R21  69.06,39.52 90 top
R22  5.74,13.59 90 top
R23  4.32,13.59 90 top
R48  120  [R0402']  51.56,34.8 90 top
R49  20k  [R0402']  55.37,37.72 0 top
R50  20k  [R0402']  50.29,37.21 180 top
R51  10k  [R0402']  34.8,23.11 90 top
R52  100k  [R0402']  40.64,27.94 180 top
SJ1  53.21,34.8 90 top
SW0  62.74,8.89 90 top
SW1  70.36,8.89 90 top
SW2  77.98,8.89 90 top
SW3  85.6,8.89 90 top
U1  15.24,30.48 0 top
U$9  75.44,38.73 270 top
X1  95.76,55.88 180 top
X2  85.6,55.88 180 top
X4  75.44,55.88 180 top

### Tracks (layer width: path | path; a pad name or v marks a point on that pad's centre or on a via)
+3V3  (via drill 0.35)
  Top 0.2: U1.13 18.57,29.23 | 19.3,25.05 19.3,28.5 18.57,29.23 | 19.3,25.05 16.13,25.05 | U1.8 14.49,27.69 | U1.9 14.99,27.94 14.73,27.69 14.49,27.69 | C15.1 18.57,29.23 | C13.1 16.13,25.05 | IC3.13 31.24,31.5 30.48,30.73 IC3.2 28.45,30.73 27.94,30.23 27.94,29.72 | 24,25.05 27.56,25.05 | 24,25.05 19.3,25.05 | 27.94,29.72 27.94,27.94 | 27.94,27.94 27.94,25.05 | IC3.S1 27.94,29.72 | 14.49,27.69 14.49,25.05 16.13,25.05 | C20.1 27.94,27.94 | C21.1 24.38,24.38 24,24.77 24,25.05
  Top 0.305: Q7.1 17.08,44.13 16.76,44.45 13.78,44.45 | 13.78,44.45 10.48,44.45 | 10.48,44.45 7.18,44.45 | Q5.1 13.78,44.45 | Q4.1 10.48,44.45 | Q2.1 7.18,44.45 | 6.48,16.64 5.84,17.27 5.84,43.69 6.6,44.45 7.18,44.45 | 6.48,16.64 IM6.1 | R8.2 7.62,17.78 6.48,16.64 | JP5.30 R2.1 | R23.2 4.32,15.11 5.21,16 v5.74,16 | R22.2 5.74,15.01 6.24,15.51 | R51.2 34.8,24.26 | 34.8,24.26 35.43,24.26 35.88,23.81 Q10.1 | v10.69,24.8 10.95,25.05 14.49,25.05 15.66,25.05 15.69,25.02 16.57,25.02 16.6,25.05 27.56,25.05 27.94,25.05 34.01,25.05 34.8,24.26
  Top 0.61: JP5.30 JP5.28 JP5.26 JP5.24 JP5.22 JP5.20 JP5.18 JP5.16 JP5.14 JP5.12 JP5.10 JP5.8 JP5.6 JP5.4 JP5.2 | v5.74,16 6.24,15.51 7.52,14.22 IM6.1
  Top 0.813: C17.1 IM6.1 9.65,14.22 10.17,13.71 10.17,13.19 JP5.2
  Bottom 0.406: v10.69,24.8 10.69,20.95 v5.74,16
+5V  (via drill 0.35)
  Top 0.305: 66.04,20.32 R20.1 | C70.1 55.6,36.42 55.96,36.78 56.64,36.78 | 56.64,36.78 56.64,37.72 | 56.64,37.72 R49.2 | IC1.2 v60.2,27.69 | 57.66,36.78 C69.1 | 56.64,37.72 56.64,38.23 56.39,38.48 54.33,38.48 53.6,39.21 53.6,40.38 JP13.4 | 56.64,36.78 57.66,36.78 | 57.66,36.78 58.42,36.78 59.16,36.04 v59.16,35.41
  Top 0.406: MAX1.8 v43.18,29.08 | v58.42,24 60.2,24
  Top 0.508: JP16.2 75.44,20.32 66.04,20.32 63.5,20.32 62.94,19.76 IC1.4
  Top 0.813: IM6.19 56.39,14.22 | 56.39,14.22 57.4,14.22 60.2,17.02 IC1.4 60.2,24 IC1.2 | C16.1 56.39,14.22
  Bottom 0.305: JP6.2 79.25,50.8 93.98,50.8 97.03,47.75 JP12.5 97.03,41.15 77.95,22.07 77.95,20.3 JP16.2 | v60.2,27.69 60.2,30.53 59.72,31.01 59.72,34.85 v59.16,35.41
  Bottom 0.406: v43.18,29.08 48.26,24 v58.42,24
+5VA
  Top 0.305: R10.1 19.56,48.26 20.07,48.77 22.52,48.77 | 22.52,50.8 R6.1 | R7.1 22.52,49.53 | R9.1 22.52,52.07
  Top 1.016: IC2.2 IC2.4 22.52,55.88 22.52,52.07 22.52,50.8 22.52,49.53 22.52,48.77 C7.+
  Top 1.27: IC2.4 JP1.8 JP1.6 JP1.4 JP1.2
A
  Top 0.305: R50.1 51.56,37.21 | R48.2 51.56,36.45 | 51.56,36.45 51.56,37.21 | 51.56,37.21 51.56,37.99 50.94,38.62 49.11,38.62 48.52,39.21 48.52,40.38 JP13.2 | MAX1.6 45.72,32.51 49.66,36.45 51.56,36.45
B
  Top 0.305: 53.34,37.72 53.21,37.72 SJ1.2 | 53.34,37.72 54.1,37.72 | 54.1,37.72 R49.1 | 54.1,37.72 54.1,36.58 54.48,36.2 54.48,31.62 51.94,29.08 44.96,29.08 44.45,29.59 MAX1.7 | JP13.3 46.99,44.07 51.06,39.99 51.06,39.21 51.65,38.62 52.44,38.62 53.34,37.72
BAT1
  pour Top: 64.77,55.12 70.36,55.12 71.37,54.1 74.17,54.1 75.44,55.37 75.44,57.66 72.9,60.2 64.26,60.2 62.74,58.67 62.74,57.15
BAT_POL+
  pour Top: 63.5,54.61 69.85,54.61 70.61,53.85 70.61,51.82 69.34,50.55 64.01,50.55 62.74,51.82 62.74,53.85
EN
  Top 0.305: R8.1 11.18,17.78 11.43,17.53 IM6.2 12.95,12.7 57.15,12.7 61.45,17 72.14,17 74.17,19.04 JP16.4
ENC_A1
  Bottom 0.254: IM6.26 40.84,41.1 56.19,41.1 57.93,39.35 70.84,39.35 75.01,43.52 89.75,43.52 JP12.3
ENC_A2
  Bottom 0.254: IM6.30 31.14,41.56 56.49,41.56 58.24,39.8 70.56,39.8 74.73,43.97 77.5,43.97 JP6.4
ENC_B1
  Bottom 0.254: JP12.4 91.83,43.06 75.32,43.06 71.15,38.89 57.63,38.89 55.88,40.64 48.01,40.64 IM6.23
ENC_B2
  Bottom 0.254: JP6.3 75.41,44.42 74.54,44.42 70.37,40.26 58.55,40.26 56.79,42.01 29.06,42.01 IM6.31
GND  (via drill 0.35, 0.6)
  Top 0.2: U1.11 16,28.5
  Top 0.305: Q3.4 69.56,53.38 v69.6,53.34
  other vias: 61.04,15.49 68.61,15.49 76.28,15.49 66.04,10.16 63.5,10.16 73.66,12.7 71.12,12.7 88.9,10.16 81.28,10.16 81.28,2.54 88.9,2.54 69.54,42.11 70.58,42.71 69.54,43.31 86.36,27.94 78.74,25.4 83.82,25.4 81.28,27.94 93.98,40.64 91.44,40.64 88.9,35.56 88.9,38.1 96.52,38.1 96.52,35.56 93.98,33.02 91.44,33.02 30.48,50.8 30.48,43.18 33.02,43.18 27.94,43.18 27.94,50.8 33.02,50.8 83.82,30.48 86.36,33.02 88.9,30.48 66.04,30.48 68.58,27.94 58.42,22.86 63.5,22.86 50.8,53.34 50.8,50.8 18.03,28.35 18.11,32.61 18.14,35.1 16.31,26.47 55.88,45.72 58.42,45.72 60.96,45.72 60.96,43.18 58.42,43.18 33.78,29.21 8.89,7.26 50.8,30.48 48.26,30.48 48.26,33.02 40.64,33.02 43.18,33.02 25.4,27.94 25.4,30.48 38.1,30.48 38.1,27.94 38.1,25.4
  pour Top (rank 5): -2.54,63.5 -2.54,-2.54 104.14,-2.54 104.14,63.5
  pour Bottom (rank 6): -5.08,66.04 106.68,66.04 106.68,-5.08 -5.08,-5.08
GPIO12  (via drill 0.35)
  Top 0.305: IM6.13 33.28,20.31 8.37,20.31 7.87,20.8 7.87,40.03 8.49,40.64 10.16,40.64 10.88,40.64 11.81,40.64 12.26,41.09 17.74,41.09 18.98,42.33 Q7.2 | R14.1 v49.78,6.35
  Bottom 0.305: JP8.6 JP2.6 36.07,7.62 36.07,11.94 36.83,12.7 39.37,12.7 | IM6.13 39.37,12.7 | v49.78,6.35 50.01,6.57 50.01,10.5 47.8,12.7 39.37,12.7
GPIO14
  Top 0.305: IM6.12 31.25,19.81 8.13,19.81 7.36,20.57 7.36,40.38 8.13,41.15 11.6,41.15 12.05,41.6 14.9,41.6 15.68,42.38 Q5.2
  Bottom 0.305: JP8.7 JP2.7 33.53,7.62 33.53,11.81 34.42,12.7 35.31,12.7 IM6.12
GPIO14_5V  (via drill 0.35)
  Top 0.305: Q5.3 14.73,48.01 JP3.3 JP1.5 | R7.2 17.53,49.53 v17.03,49.02 v17.02,49.02
  Bottom 0.305: v17.02,49.02 16.41,48.42 15.29,48.42 14.17,49.53 JP3.3
GPIO21  (via drill 0.35)
  Top 0.305: JP8.5 36.45,2.54 35.33,1.42 11.28,1.42 v10.16,2.54 | v49.28,10.16 R17.1 | MAX1.3 45.72,27.56 45.34,27.94 44.45,27.94 | 42.37,27.94 42.37,29 33.27,38.1 22.86,38.1 21.59,39.37 IM6.33 | 44.45,27.94 42.37,27.94 | MAX1.2 44.45,27.94 | R52.1 42.37,27.94
  Bottom 0.305: JP8.5 JP2.5 38.61,7.62 40.39,7.62 41.2,8.43 41.2,9.45 41.91,10.16 v49.28,10.16 | v10.16,2.54 10.16,16.26 21.59,27.69 IM6.33
GPIO25  (via drill 0.35)
  Top 0.305: R13.1 50.55,3.81 v50.04,3.3
  Bottom 0.305: IM6.9 27.58,12.6 26.69,12.6 25.91,11.81 25.91,7.62 JP2.10 JP8.10 25.75,1.43 48.16,1.43 v50.04,3.3
GPIO26  (via drill 0.35)
  Top 0.305: R16.1 v50.55,5.08
  Bottom 0.305: JP8.9 JP2.9 28.45,7.62 28.45,11.81 29.23,12.6 30.12,12.6 IM6.10 32.77,15.24 39.78,15.24 40.38,14.64 40.38,14.23 41.41,13.21 48.01,13.21 50.55,10.67 v50.55,5.08
GPIO27
  Top 0.305: JP2.8 30.84,5.22 46.39,5.22 49.07,2.54 R15.1
  Bottom 0.305: JP8.8 JP2.8 30.99,7.62 30.99,11.81 31.77,12.6 32.66,12.6 IM6.11
GPIO32
  Top 0.305: IM6.7 19.56,18.8 7.62,18.8 6.35,20.07 6.35,40.89 7.62,42.16 8.89,42.16 9.08,42.35 Q2.2
  Bottom 0.305: JP8.12 JP2.12 20.83,7.62 20.83,11.94 21.59,12.7 22.61,12.7 IM6.7
GPIO32-5V
  Top 0.305: Q7.3 18.03,46.74 16.76,48.01 | 16.76,48.01 15.75,49.02 JP3.4 JP1.7 | R10.2 17.02,48.26 16.76,48.01
GPIO33
  Top 0.305: IM6.8 21.59,19.3 7.88,19.3 6.86,20.32 6.86,40.64 7.88,41.66 11.4,41.66 11.84,42.1 12.13,42.1 12.19,42.16 12.38,42.35 Q4.2
  Bottom 0.305: JP8.11 JP2.11 23.37,7.62 23.37,11.81 24.15,12.6 25.04,12.6 IM6.8
GPIO33-5V  (via drill 0.35)
  Top 0.305: Q4.3 11.43,48.77 JP3.2 JP1.3 | R6.2 v17.02,50.8
  Bottom 0.305: v17.02,50.8 11.94,50.8 JP3.2
GPIO34  (via drill 0.35)
  Top 0.305: R12.2 50.04,23.37 47.5,20.83 19.3,20.83 v19.05,21.08
  Bottom 0.305: v19.05,21.08 IM6.5
GPIO35
  Top 0.305: JP42.3 JP48.3 JP47.3
  Bottom 0.305: JP8.13 JP2.13 18.29,7.62 18.29,11.94 19.05,12.7 20.07,12.7 IM6.6 22.86,15.49 22.86,51.05 30.21,58.4 30.23,58.39 JP42.3
GPIO36  (via drill 0.35)
  Top 0.2: R18.1 49.59,8.89 48.11,10.37 14.45,10.37 13.21,9.12 13.21,7.62 JP2.15
  Top 0.305: v17.14,21.08 17.14,21.16 18.33,22.35 33.3,22.35 v33.53,22.57 | v46.99,22.99 MAX1.4
  Bottom 0.305: JP8.15 JP2.15 13.21,7.62 13.21,13.46 IM6.3 17.14,17.39 v17.14,21.08 | v33.53,22.57 46.58,22.57 v46.99,22.99
GPIO39  (via drill 0.35)
  Top 0.2: R19.1 50.29,7.62 47.96,9.95 16.58,9.95 15.75,9.12 15.75,7.62 JP2.14
  Top 0.305: 34.8,21.84 36.93,21.84 Q10.2 | R51.1 34.8,21.84 | v18.09,21.08 18.09,21.16 18.78,21.84 34.8,21.84
  Bottom 0.305: JP8.14 JP2.14 15.75,7.62 15.75,13.46 IM6.4 18.09,15.81 v18.09,21.08
INT_MPU5060
  Top 0.2: U1.12 16.49,27.93 JP10.1
IO1  (via drill 0.35)
  Top 0.305: JP8.3 41.53,2.54 39.86,4.21 9.09,4.21 8.45,4.85 7.77,4.85 v7.45,4.52
  Bottom 0.305: JP8.3 JP2.3 | v7.45,4.52 7.33,4.64 7.33,14.87 14.47,22.02 14.47,37.59 IM6.35
IO3  (via drill 0.35)
  Top 0.305: JP8.4 38.99,2.54 37.82,3.71 8.48,3.71 v8.38,3.81
  Bottom 0.305: JP2.4 JP8.4 | v8.38,3.81 8.38,4.9 7.83,5.45 7.83,14.66 8.45,15.28 8.47,15.28 19.05,25.86 IM6.34
LED0
  Top 0.305: 64.51,15.25 64.26,15.49 LED0.A | R17.2 56.13,10.16 56.38,10.41 56.38,10.91 60.2,14.73 63.96,14.73 64.47,15.25 64.51,15.25 | JP9.1 87.12,16.76 75.69,16.76 75.17,16.25 68.33,16.25 67.33,15.25 64.51,15.25
LED1
  Top 0.305: R18.2 56.13,8.89 56.89,9.65 56.89,10.71 60.41,14.23 64.17,14.23 64.68,14.74 71.56,14.74 72.07,15.25 72.13,15.25 | 72.13,15.25 71.88,15.49 LED1.A | JP9.3 89.15,16.26 75.95,16.26 74.94,15.25 72.13,15.25
LED2
  Top 0.305: R19.2 56.13,7.62 57.4,8.9 57.4,10.51 60.62,13.72 64.38,13.72 64.89,14.24 71.77,14.24 72.28,14.74 79.43,14.74 | 79.43,14.74 79.43,15.32 79.25,15.49 LED2.A | 79.43,14.74 88.4,14.74 91.57,17.91 93.34,17.91 JP9.5
LED3
  Top 0.305: R20.2 66.04,24.13 65.79,24.38 65.02,24.38 64.77,24.13 LED3.A
M1A
  pour Top: 76.63,42.37 77.09,41.91 77.22,41.91 77.98,41.15 88.65,41.15 90.17,42.67 98.55,42.67 100.84,44.96 100.84,58.42 99.57,59.69 97.28,59.69 96.01,58.42 96.01,52.07 86.92,42.98 77.24,42.98
M1B  (1 unrouted)
  pour Top (rank 2): 75.49,42.16 76.1,42.16 77.17,43.23 86.92,43.23 95.76,52.07 95.76,58.42 94.49,59.69 92.2,59.69 90.93,58.42 90.93,54.36 85.6,49.02 85.6,44.7 85.09,44.2 76.45,44.2 75.49,43.23
M2A
  pour Top (rank 2): 73.66,41.91 74.42,41.91 74.42,42.93 85.6,54.1 85.6,58.67 84.58,59.69 81.53,59.69 80.52,58.67 80.52,55.88 71.88,47.24 71.12,47.24 70.36,46.48 70.36,45.21
M2B
  pour Top: 74.75,42.09 74.93,41.91 75.52,41.91 75.52,43.51 76.45,44.45 85.09,44.45 85.34,44.7 85.34,49.28 90.68,54.61 90.68,58.42 89.41,59.69 87.12,59.69 85.85,58.42 85.85,55.37 78.74,48.26 76.96,48.26 74.75,46.05
N$1
  Top 0.305: R5.2 53.34,23.37 | 53.34,23.37 R11.1 | R12.1 53.34,23.37
N$2
  Top 0.305: LED4.C R21.1
N$3
  Top 0.2: U1.20 15.99,33.58 16.11,33.71 C12.1
N$4
  Top 0.2: C14.1 15.42,26.92 15.49,26.99 U1.10
N$5  (via drill 0.35)
  Top 0.305: Q2.3 JP3.1 JP1.1 | v17.02,52.07 R9.2
  Bottom 0.305: JP3.1 9.9,51.3 16.25,51.3 v17.02,52.07
N$6
  Top 0.305: R48.1 51.56,33.15 51.82,32.89 52.96,32.89 53.21,33.15 SJ1.1
N$23
  pour Top (rank 3): 76.05,35.15 76.05,34.21 76.71,33.55 79.27,33.55 80.77,35.05 80.77,36.63 77.98,36.63 77.98,34.85 77.83,34.7 76.96,34.7 76.81,34.85 76.81,35.15
N$25
  pour Top: 73.74,32.89 74.68,33.83 74.68,35.18 74.17,35.18 74.17,34.29 73.28,33.4 73.28,32.89
N$60
  Top 0.2: C18.1 35.56,30.86 35.18,31.24 IC3.12
N$62
  Top 0.2: IC3.8 31.24,27.52 31.42,27.34 34.96,27.34 35.56,27.94 C18.2
N$66
  Top 0.2: IC3.10 32.64,30.23 32.72,30.31 C19.1
OFF  (via drill 0.35)
  Top 0.305: 53.21,52.58 BOOT.4 53.21,45.85 60.66,38.41 v60.66,35.15 | 53.21,52.58 BOOT.3 | Q6.1 60.39,50.48 60.45,50.55 60.45,51.56 59.44,52.58 57.15,52.58 | 57.15,52.58 55.12,52.58 | 55.12,52.58 53.21,52.58 | C2.1 57.15,52.58 | R1.1 55.12,52.58 | R2.2 v52.32,11.43
  Bottom 0.305: IM6.15 46.48,16.26 48.26,16.26 | 48.26,16.26 66.29,16.26 JP16.8 67.82,20.32 67.82,23.62 60.66,30.79 v60.66,35.15 | v52.32,11.43 50.5,11.43 48.26,13.67 48.26,16.26
ON  (via drill 0.35)
  Top 0.254: 47.15,48.23 48.26,48.23 | 46.86,48.52 46.86,50.8
  Top 0.305: 46.86,54.1 46.86,50.8 ON.4 46.86,48.52 47.15,48.23 | 46.86,54.1 ON.3 | C1.2 56.13,54.61 55.67,55.08 55.67,57.15 | 55.67,57.15 55.12,57.69 48.76,57.69 48.51,57.44 48.51,54.86 47.75,54.1 46.86,54.1 | R4.2 55.67,57.15 | 48.26,48.23 50.09,48.23 59.9,38.41 59.9,34.85 60.35,34.4 v61.39,34.4 v61.39,34.39
  Bottom 0.305: v61.39,34.39 61.39,30.96 70.36,22 70.36,20.32 JP16.6
PWM_A0  (via drill 0.35)
  Top 0.305: U$9.16 77.71,36.82 77.79,36.9 77.79,37.85 v77.7,37.95
  Bottom 0.254: 42.04,39.5 IM6.25
  Bottom 0.305: 42.04,39.5 43.62,37.91 72.72,37.91 73.25,38.45 76.54,38.45 77.05,37.95 v77.7,37.95
PWM_A1  (via drill 0.35)
  Top 0.305: U$9.15 v77.06,37.2
  Bottom 0.305: IM6.27 39.05,37.41 72.95,37.41 73.48,37.94 76.32,37.94 v77.06,37.2
PWM_B0  (via drill 0.35)
  Top 0.305: U$9.9 72.47,35.87 v72.39,35.94
  Bottom 0.305: IM6.29 35,36.37 71.96,36.37 v72.39,35.94
PWM_B1  (via drill 0.35)
  Top 0.305: U$9.10 v73.81,37.2
  Bottom 0.305: IM6.28 37.01,36.9 73.51,36.9 v73.81,37.2
QMC5883-INTERRUPT
  Top 0.2: IC3.15 JP11.1
RX-485-5V
  Top 0.305: Q10.3 42.67,22.86 43.18,23.37 MAX1.1
SCL  (via drill 0.35)
  Top 0.2: IM6.36 13.97,36.83 | 13.97,36.83 13.97,35.05 14.49,34.53 U1.23 | IC3.1 28.19,31.24 22.61,36.83 13.97,36.83
  Top 0.305: JP8.2 44.07,2.54 41.89,4.72 9.3,4.72 8.66,5.36 v6.53,5.36 4.32,7.57 R23.1
  Bottom 0.305: v6.53,5.36 6.53,14.79 13.97,22.23 IM6.36 | JP8.2 JP2.2
SDA  (via drill 0.35)
  Top 0.2: U1.24 13.99,34.27 11.43,36.83 IM6.37 12.45,40.64 14.3,40.64 15.24,39.7 15.24,38.1 16.11,37.23 22.84,37.23 27.05,33.02 29.34,33.02 29.72,32.64 IC3.16
  Top 0.305: JP2.1 46.53,6.35 45.42,7.46 29.26,7.46 28.6,6.81 28.6,6.2 27.64,5.24 11.48,5.24 11.42,5.29 9.44,5.29 8.87,5.86 7.5,5.86 v5.74,7.62 R22.1
  Bottom 0.305: v5.74,7.62 5.74,14.72 11.43,20.41 IM6.37 | JP8.1 JP2.1
SLEEP  (via drill 0.35)
  Top 0.254: U$9.1 77.76,41.66 v78.54,41.66
  Bottom 0.305: IM6.24 45.66,38.41 71.44,38.41 74.68,41.66 v78.54,41.66
START_GATE1
  Top 0.305: 61.72,54.61 61.72,56.39 60.96,57.15 R4.1 | 61.72,54.61 61.72,50.8 62.23,50.29 62.74,50.29 | 62.74,50.29 62.74,49.78 62.48,49.53 Q6.3 | 62.74,50.29 62.74,51.05 | 62.74,51.05 R3.2 | Q1.4 63.84,51.52 63.37,51.05 62.74,51.05 | C1.1 61.72,54.61
SW0  (via drill 0.35)
  Top 0.305: 60.84,8.89 SW0.3 60.84,3.81 | 60.84,8.89 SW0.4 | C5.2 60.84,3.81 | 60.84,8.89 v61.72,8.89 | R13.2 60.84,3.81
  Bottom 0.305: JP4.8 79.25,12.91 75.96,9.62 69.04,9.62 68.31,8.89 v61.72,8.89
SW1  (via drill 0.35)
  Top 0.305: 68.46,8.89 SW1.3 68.46,4.7 67.94,4.19 | 68.46,8.89 SW1.4 | C3.2 67.69,3.81 67.69,3.94 67.94,4.19 | R14.2 58.93,6.35 v59.44,5.84 | v67.31,4.83 67.94,4.19 | 68.46,8.89 v69.34,8.89
  Bottom 0.305: v59.44,5.84 59.89,5.39 60.06,5.39 60.49,4.96 60.49,4.79 61.21,4.06 66.55,4.06 v67.31,4.83 | v69.34,8.89 75.95,8.89 81.79,14.73 JP4.6
SW2  (via drill 0.35)  (1 unrouted)
  Top 0.305: SW2.4 76.08,8.89 | 76.08,8.89 SW2.3 76.08,3.81 C4.2 | R15.2 74.8,2.54 76.07,3.81 | 76.08,8.89 v77.22,8.89
  Bottom 0.305: v77.22,8.89 77.22,9.4 84.33,16.51 JP4.4
SW3  (via drill 0.35)
  Top 0.305: C8.2 83.69,3.56 | 83.69,3.56 SW3.3 83.7,8.89 | 83.7,8.89 SW3.4 | R16.2 59.34,5.08 v59.76,4.66 | v82.04,3.56 83.69,3.56 | 83.7,8.89 v84.84,8.89
  Bottom 0.305: v59.76,4.66 60.86,3.56 v82.04,3.56 | v84.84,8.89 86.87,10.92 JP4.2
VCC  (via drill 0.35, 0.6, 1)  (2 unrouted)
  Top 0.2: C23.2 75.69,32.51 75.69,33.02 75.17,33.54 U$9.12
  Top 0.305: R5.1 53.34,26.66 54.62,27.94 57.89,27.94 | C6.+ 83.99,34.8 83.02,33.83 v88.9,27.94
  Top 0.813: IC1.3 57.89,27.91 67.44,37.47
  Bottom 0.305: v88.9,27.94 92.71,24.13 94.23,24.13 95.69,22.68 95.69,20.39 JP9.7
  Bottom 1.9: JP47.2 40.89,56.39
  Bottom 2.54: 40.89,56.39 54.36,56.39 66.04,44.7 | v64.48,43.9 65.07,43.97 v66.04,43 v66.04,44.8
  other vias: 41.15,57.15 41.15,55.63
  pour Top (rank 2): 73.91,32.66 73.91,30.48 81.28,30.48 84.58,33.78 85.6,33.78 87.12,35.31 87.12,38.1 86.11,39.12 81.79,39.12 81.03,38.35 81.03,35.05 79.32,33.35 76.71,33.35 75.31,34.75 75.31,35.18 74.8,35.18 74.8,33.55
  pour Top (rank 3): 64.26,50.29 63.5,49.53 63.5,35.56 68.58,30.48 75.18,30.48 75.18,34.54 71.12,34.54 67.82,37.85 67.82,44.83 68.83,45.85 68.83,50.29
  pour Top: 21.84,59.18 21.84,55.88 25.4,55.88 26.16,55.12 32,55.12 33.78,53.34 33.78,47.24 34.8,46.23 37.34,46.23 37.59,46.48 37.59,54.1 38.35,54.86 41.15,54.86 41.66,55.37 41.66,58.67 41.15,59.18
  pour Bottom (rank 2): 62.97,46.02 62.97,43.46 64.47,41.96 64.57,41.86 66.01,41.86 66.01,44.93 64.82,46.13 64.34,46.61 63.37,46.61 63.3,46.61 63.02,46.33 62.97,46.28

### Text on the board
tNames: GND | +5V | B | A | A | B | 32 | 33 | 14 | 12 | 5V | GND | GND | 5V | QMC-interupt | MPU-interupt | OFF | ON | EN | +5V | SW0 | SW1 | SW2 | SW3 | LED0 | LED1 | LED2 | VCC | 3V3 | GND | GPIO | 36 | 39 | 35 | 32 | 33 | 25 | 26 | 27 | 14 | 12 | 21 | 3 | 1 | I2C | GPIO | SCL | SDA
bNames: + | -
135bmp: C:/Users/Tomas_Vavrinec/Desktop/83230147_1110853902579322_2686908253064921088_n.bmp
200bmp: C:/Users/Tomas_Vavrinec/Desktop/83230147_1110853902579322_2686908253064921088_n.bmp | C:/Users/Tomas_Vavrinec/Desktop/83230147_1110853902579322_2686908253064921088_n.bmp
201bmp: C:/Users/Tomas_Vavrinec/Desktop/83230147_1110853902579322_2686908253064921088_n.bmp